# EAGLE design SIK-DIP-board (EAGLE 6.5.0)
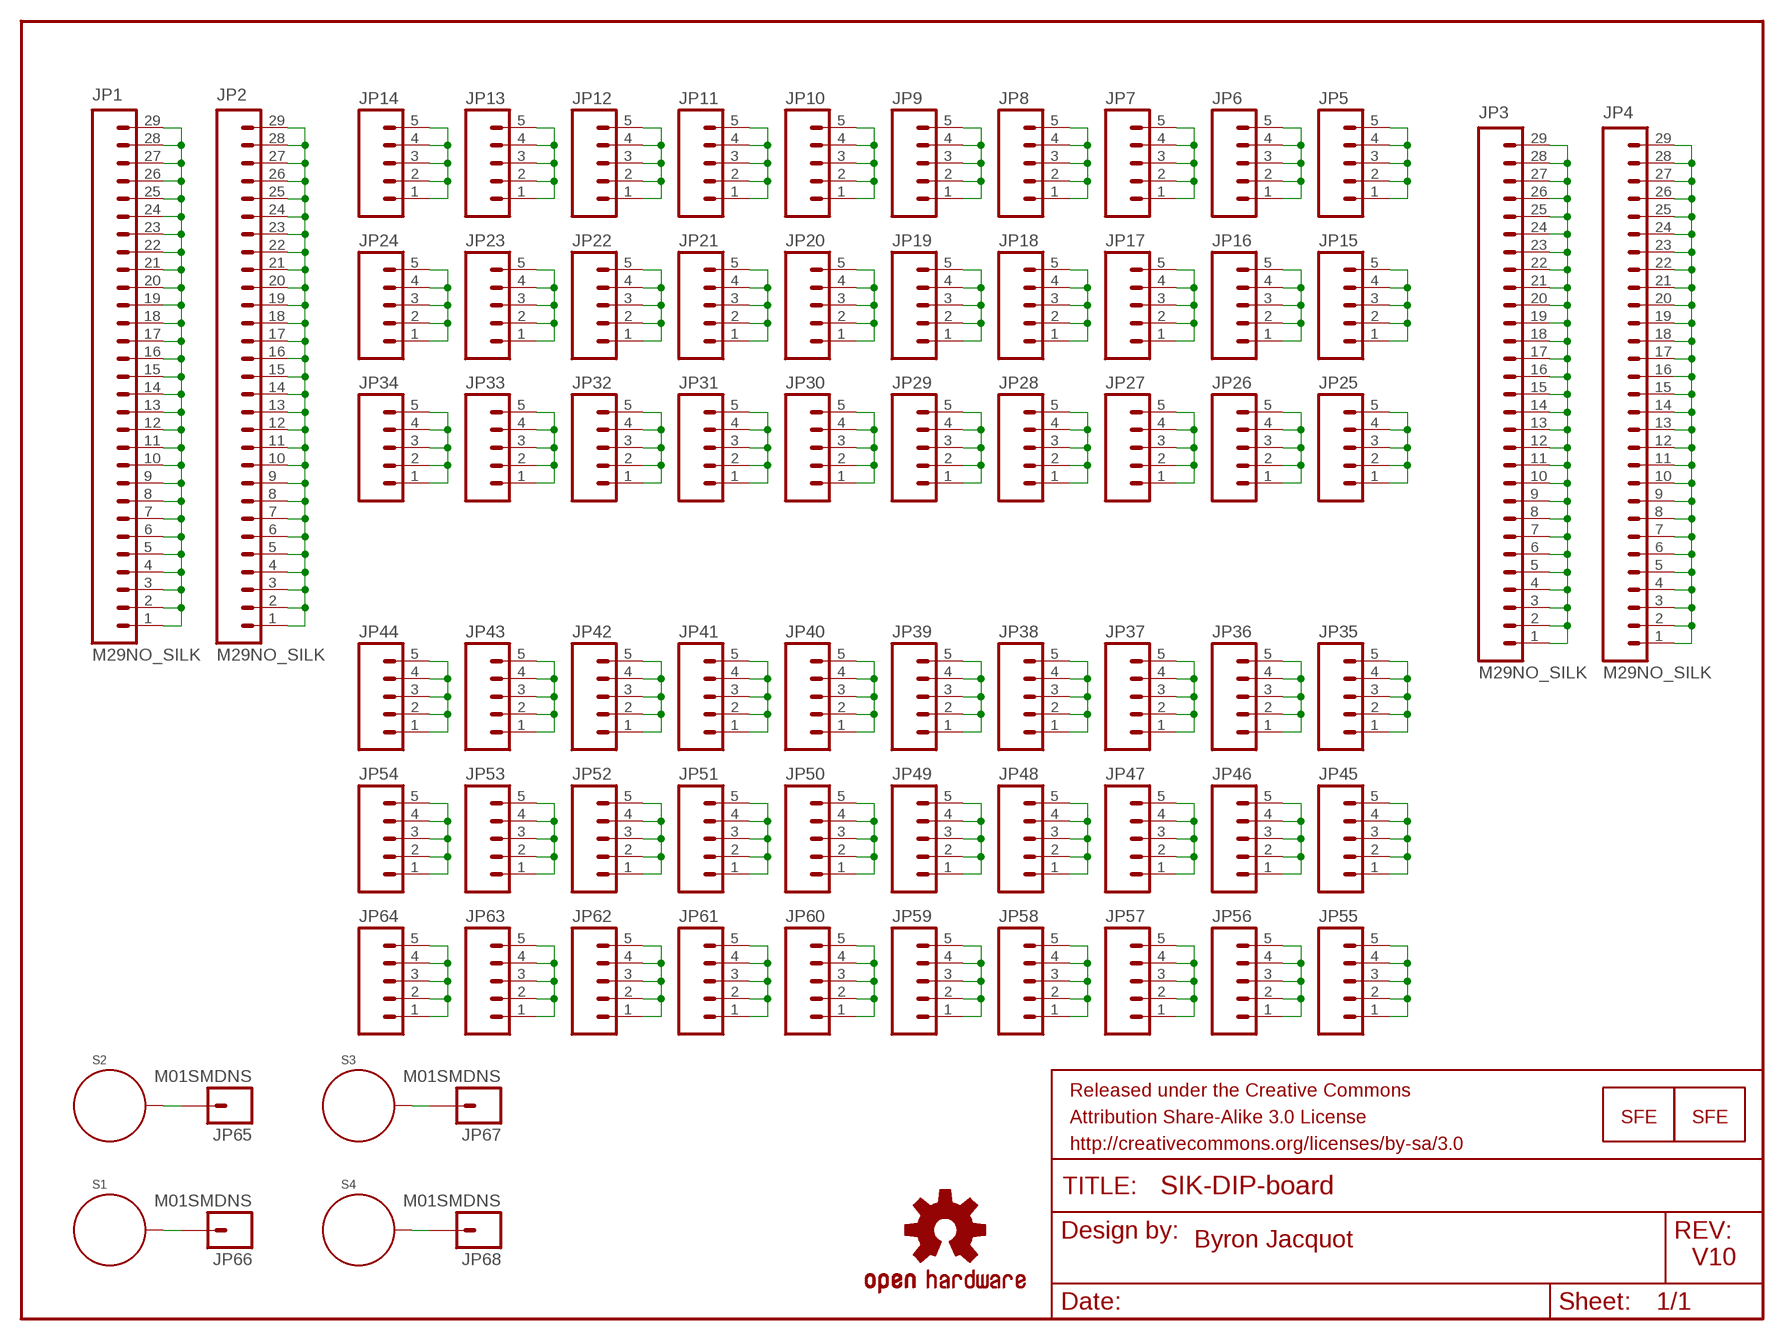
[diagram p0: schematic, sheet 1]

## Parts
FRAME1  FRAME-LETTER  [CREATIVE_COMMONS]
JP1  M29NO_SILK  [1X29_NO_SILK]
JP2  M29NO_SILK  [1X29_NO_SILK]
JP3  M29NO_SILK  [1X29_NO_SILK]
JP4  M29NO_SILK  [1X29_NO_SILK]
JP5  M05NO_SILK  [1X05_NO_SILK]
JP6  M05NO_SILK  [1X05_NO_SILK]
JP7  M05NO_SILK  [1X05_NO_SILK]
JP8  M05NO_SILK  [1X05_NO_SILK]
JP9  M05NO_SILK  [1X05_NO_SILK]
JP10  M05NO_SILK  [1X05_NO_SILK]
JP11  M05NO_SILK  [1X05_NO_SILK]
JP12  M05NO_SILK  [1X05_NO_SILK]
JP13  M05NO_SILK  [1X05_NO_SILK]
JP14  M05NO_SILK  [1X05_NO_SILK]
JP15  M05NO_SILK  [1X05_NO_SILK]
JP16  M05NO_SILK  [1X05_NO_SILK]
JP17  M05NO_SILK  [1X05_NO_SILK]
JP18  M05NO_SILK  [1X05_NO_SILK]
JP19  M05NO_SILK  [1X05_NO_SILK]
JP20  M05NO_SILK  [1X05_NO_SILK]
JP21  M05NO_SILK  [1X05_NO_SILK]
JP22  M05NO_SILK  [1X05_NO_SILK]
JP23  M05NO_SILK  [1X05_NO_SILK]
JP24  M05NO_SILK  [1X05_NO_SILK]
JP25  M05NO_SILK  [1X05_NO_SILK]
JP26  M05NO_SILK  [1X05_NO_SILK]
JP27  M05NO_SILK  [1X05_NO_SILK]
JP28  M05NO_SILK  [1X05_NO_SILK]
JP29  M05NO_SILK  [1X05_NO_SILK]
JP30  M05NO_SILK  [1X05_NO_SILK]
JP31  M05NO_SILK  [1X05_NO_SILK]
JP32  M05NO_SILK  [1X05_NO_SILK]
JP33  M05NO_SILK  [1X05_NO_SILK]
JP34  M05NO_SILK  [1X05_NO_SILK]
JP35  M05NO_SILK  [1X05_NO_SILK]
JP36  M05NO_SILK  [1X05_NO_SILK]
JP37  M05NO_SILK  [1X05_NO_SILK]
JP38  M05NO_SILK  [1X05_NO_SILK]
JP39  M05NO_SILK  [1X05_NO_SILK]
JP40  M05NO_SILK  [1X05_NO_SILK]
JP41  M05NO_SILK  [1X05_NO_SILK]
JP42  M05NO_SILK  [1X05_NO_SILK]
JP43  M05NO_SILK  [1X05_NO_SILK]
JP44  M05NO_SILK  [1X05_NO_SILK]
JP45  M05NO_SILK  [1X05_NO_SILK]
JP46  M05NO_SILK  [1X05_NO_SILK]
JP47  M05NO_SILK  [1X05_NO_SILK]
JP48  M05NO_SILK  [1X05_NO_SILK]
JP49  M05NO_SILK  [1X05_NO_SILK]
JP50  M05NO_SILK  [1X05_NO_SILK]
JP51  M05NO_SILK  [1X05_NO_SILK]
JP52  M05NO_SILK  [1X05_NO_SILK]
JP53  M05NO_SILK  [1X05_NO_SILK]
JP54  M05NO_SILK  [1X05_NO_SILK]
JP55  M05NO_SILK  [1X05_NO_SILK]
JP56  M05NO_SILK  [1X05_NO_SILK]
JP57  M05NO_SILK  [1X05_NO_SILK]
JP58  M05NO_SILK  [1X05_NO_SILK]
JP59  M05NO_SILK  [1X05_NO_SILK]
JP60  M05NO_SILK  [1X05_NO_SILK]
JP61  M05NO_SILK  [1X05_NO_SILK]
JP62  M05NO_SILK  [1X05_NO_SILK]
JP63  M05NO_SILK  [1X05_NO_SILK]
JP64  M05NO_SILK  [1X05_NO_SILK]
JP65  M01SMDNS  [1X01NS]
JP66  M01SMDNS  [1X01NS]
JP67  M01SMDNS  [1X01NS]
JP68  M01SMDNS  [1X01NS]
LOGO1  LOGO-SFECP  [SFE-LOGO-FLAME-COPPER]
LOGO2  LOGO-SFENEW  [SFE-NEW-WEBLOGO]
LOGO3  OSHW-LOGOS  [OSHW-LOGO-S]
S1  STANDOFF_ELECTRICAL  [STANDOFF-ELECTRICAL]
S2  STANDOFF_ELECTRICAL  [STANDOFF-ELECTRICAL]
S3  STANDOFF_ELECTRICAL  [STANDOFF-ELECTRICAL]
S4  STANDOFF_ELECTRICAL  [STANDOFF-ELECTRICAL]

## Nets
N$1: JP1.1 JP1.2 JP1.3 JP1.4 JP1.5 JP1.6 JP1.7 JP1.8 JP1.9 JP1.10 JP1.11 JP1.12 JP1.13 JP1.14 JP1.15 JP1.16 JP1.17 JP1.18 JP1.19 JP1.20 JP1.21 JP1.22 JP1.23 JP1.24 JP1.25 JP1.26 JP1.27 JP1.28 JP1.29
N$2: JP2.1 JP2.2 JP2.3 JP2.4 JP2.5 JP2.6 JP2.7 JP2.8 JP2.9 JP2.10 JP2.11 JP2.12 JP2.13 JP2.14 JP2.15 JP2.16 JP2.17 JP2.18 JP2.19 JP2.20 JP2.21 JP2.22 JP2.23 JP2.24 JP2.25 JP2.26 JP2.27 JP2.28 JP2.29
N$3: JP3.1 JP3.2 JP3.3 JP3.4 JP3.5 JP3.6 JP3.7 JP3.8 JP3.9 JP3.10 JP3.11 JP3.12 JP3.13 JP3.14 JP3.15 JP3.16 JP3.17 JP3.18 JP3.19 JP3.20 JP3.21 JP3.22 JP3.23 JP3.24 JP3.25 JP3.26 JP3.27 JP3.28 JP3.29
N$4: JP4.1 JP4.2 JP4.3 JP4.4 JP4.5 JP4.6 JP4.7 JP4.8 JP4.9 JP4.10 JP4.11 JP4.12 JP4.13 JP4.14 JP4.15 JP4.16 JP4.17 JP4.18 JP4.19 JP4.20 JP4.21 JP4.22 JP4.23 JP4.24 JP4.25 JP4.26 JP4.27 JP4.28 JP4.29
N$5: JP10.1 JP10.2 JP10.3 JP10.4 JP10.5
N$6: JP5.1 JP5.2 JP5.3 JP5.4 JP5.5
N$7: JP6.1 JP6.2 JP6.3 JP6.4 JP6.5
N$8: JP7.1 JP7.2 JP7.3 JP7.4 JP7.5
N$9: JP8.1 JP8.2 JP8.3 JP8.4 JP8.5
N$10: JP9.1 JP9.2 JP9.3 JP9.4 JP9.5
N$11: JP11.1 JP11.2 JP11.3 JP11.4 JP11.5
N$12: JP12.1 JP12.2 JP12.3 JP12.4 JP12.5
N$13: JP13.1 JP13.2 JP13.3 JP13.4 JP13.5
N$14: JP14.1 JP14.2 JP14.3 JP14.4 JP14.5
N$15: JP15.1 JP15.2 JP15.3 JP15.4 JP15.5
N$16: JP16.1 JP16.2 JP16.3 JP16.4 JP16.5
N$17: JP17.1 JP17.2 JP17.3 JP17.4 JP17.5
N$18: JP18.1 JP18.2 JP18.3 JP18.4 JP18.5
N$19: JP19.1 JP19.2 JP19.3 JP19.4 JP19.5
N$20: JP20.1 JP20.2 JP20.3 JP20.4 JP20.5
N$21: JP21.1 JP21.2 JP21.3 JP21.4 JP21.5
N$22: JP22.1 JP22.2 JP22.3 JP22.4 JP22.5
N$23: JP23.1 JP23.2 JP23.3 JP23.4 JP23.5
N$24: JP24.1 JP24.2 JP24.3 JP24.4 JP24.5
N$25: JP25.1 JP25.2 JP25.3 JP25.4 JP25.5
N$26: JP26.1 JP26.2 JP26.3 JP26.4 JP26.5
N$27: JP27.1 JP27.2 JP27.3 JP27.4 JP27.5
N$28: JP28.1 JP28.2 JP28.3 JP28.4 JP28.5
N$29: JP29.1 JP29.2 JP29.3 JP29.4 JP29.5
N$30: JP30.1 JP30.2 JP30.3 JP30.4 JP30.5
N$31: JP31.1 JP31.2 JP31.3 JP31.4 JP31.5
N$32: JP32.1 JP32.2 JP32.3 JP32.4 JP32.5
N$33: JP33.1 JP33.2 JP33.3 JP33.4 JP33.5
N$34: JP34.1 JP34.2 JP34.3 JP34.4 JP34.5
N$35: JP35.1 JP35.2 JP35.3 JP35.4 JP35.5
N$36: JP36.1 JP36.2 JP36.3 JP36.4 JP36.5
N$37: JP37.1 JP37.2 JP37.3 JP37.4 JP37.5
N$38: JP38.1 JP38.2 JP38.3 JP38.4 JP38.5
N$39: JP39.1 JP39.2 JP39.3 JP39.4 JP39.5
N$40: JP40.1 JP40.2 JP40.3 JP40.4 JP40.5
N$41: JP41.1 JP41.2 JP41.3 JP41.4 JP41.5
N$42: JP42.1 JP42.2 JP42.3 JP42.4 JP42.5
N$43: JP43.1 JP43.2 JP43.3 JP43.4 JP43.5
N$44: JP44.1 JP44.2 JP44.3 JP44.4 JP44.5
N$45: JP45.1 JP45.2 JP45.3 JP45.4 JP45.5
N$46: JP46.1 JP46.2 JP46.3 JP46.4 JP46.5
N$47: JP47.1 JP47.2 JP47.3 JP47.4 JP47.5
N$48: JP48.1 JP48.2 JP48.3 JP48.4 JP48.5
N$49: JP49.1 JP49.2 JP49.3 JP49.4 JP49.5
N$50: JP50.1 JP50.2 JP50.3 JP50.4 JP50.5
N$51: JP51.1 JP51.2 JP51.3 JP51.4 JP51.5
N$52: JP52.1 JP52.2 JP52.3 JP52.4 JP52.5
N$53: JP53.1 JP53.2 JP53.3 JP53.4 JP53.5
N$54: JP54.1 JP54.2 JP54.3 JP54.4 JP54.5
N$55: JP55.1 JP55.2 JP55.3 JP55.4 JP55.5
N$56: JP56.1 JP56.2 JP56.3 JP56.4 JP56.5
N$57: JP57.1 JP57.2 JP57.3 JP57.4 JP57.5
N$58: JP58.1 JP58.2 JP58.3 JP58.4 JP58.5
N$59: JP59.1 JP59.2 JP59.3 JP59.4 JP59.5
N$60: JP60.1 JP60.2 JP60.3 JP60.4 JP60.5
N$61: JP61.1 JP61.2 JP61.3 JP61.4 JP61.5
N$62: JP62.1 JP62.2 JP62.3 JP62.4 JP62.5
N$63: JP63.1 JP63.2 JP63.3 JP63.4 JP63.5
N$64: JP64.1 JP64.2 JP64.3 JP64.4 JP64.5
N$65: JP65.1 S2.P1
N$66: JP66.1 S1.P1
N$67: JP67.1 S3.P1
N$68: JP68.1 S4.P1

## Notes on the sheet
- Byron Jacquot
- V10

## Library data of the parts
FRAME1 = SparkFun-Aesthetics:FRAME-LETTER: Schematic Frame Standard 8.5x11 US Letter frame
JP1-JP4 = SparkFun-Connectors:M29: 1x29 .1" header
JP5-JP64 = SparkFun-Connectors:M05: Header 5 Standard 5-pin 0.1" header. Use with straight break away headers (SKU : PRT-00116), right angle break away headers (PRT-00553), swiss pins (PRT-00743), machine pins (PRT-00117), and female headers (PRT-00115). Molex polarized connector foot print use with SKU : PRT-08230 with associated crimp pins and housings.
JP65-JP68 = SparkFun-Connectors:M01: Header 1 Standard 1-pin 0.1" header. Use with straight break away headers (SKU : PRT-00116), right angle break away headers (PRT-00553), swiss pins (PRT-00743), machine pins (PRT-00117), and female headers (PRT-00115).
LOGO1 LOGO2 = SparkFun-Aesthetics:LOGO-SFE: Spark Fun Electronics PCB Logo This is the standard Spark Fun Electronics PCB logo.
LOGO3 = SparkFun-Aesthetics:OSHW-LOGO: Open Source Hardware Logo This logo indicates the piece of hardware it is found on incorporates a OSHW license and/or adheres to the definition of open source hardware found here: http://freedomdefined.org/OSHW
S1-S4 = SparkFun-Electromechanical:STANDOFF_ELECTRICAL: A standoff intended to be an electrically connected point. Pad size and stop size allow for a #4 Phillips pan screw head to make a solid connection to the board.

## Board
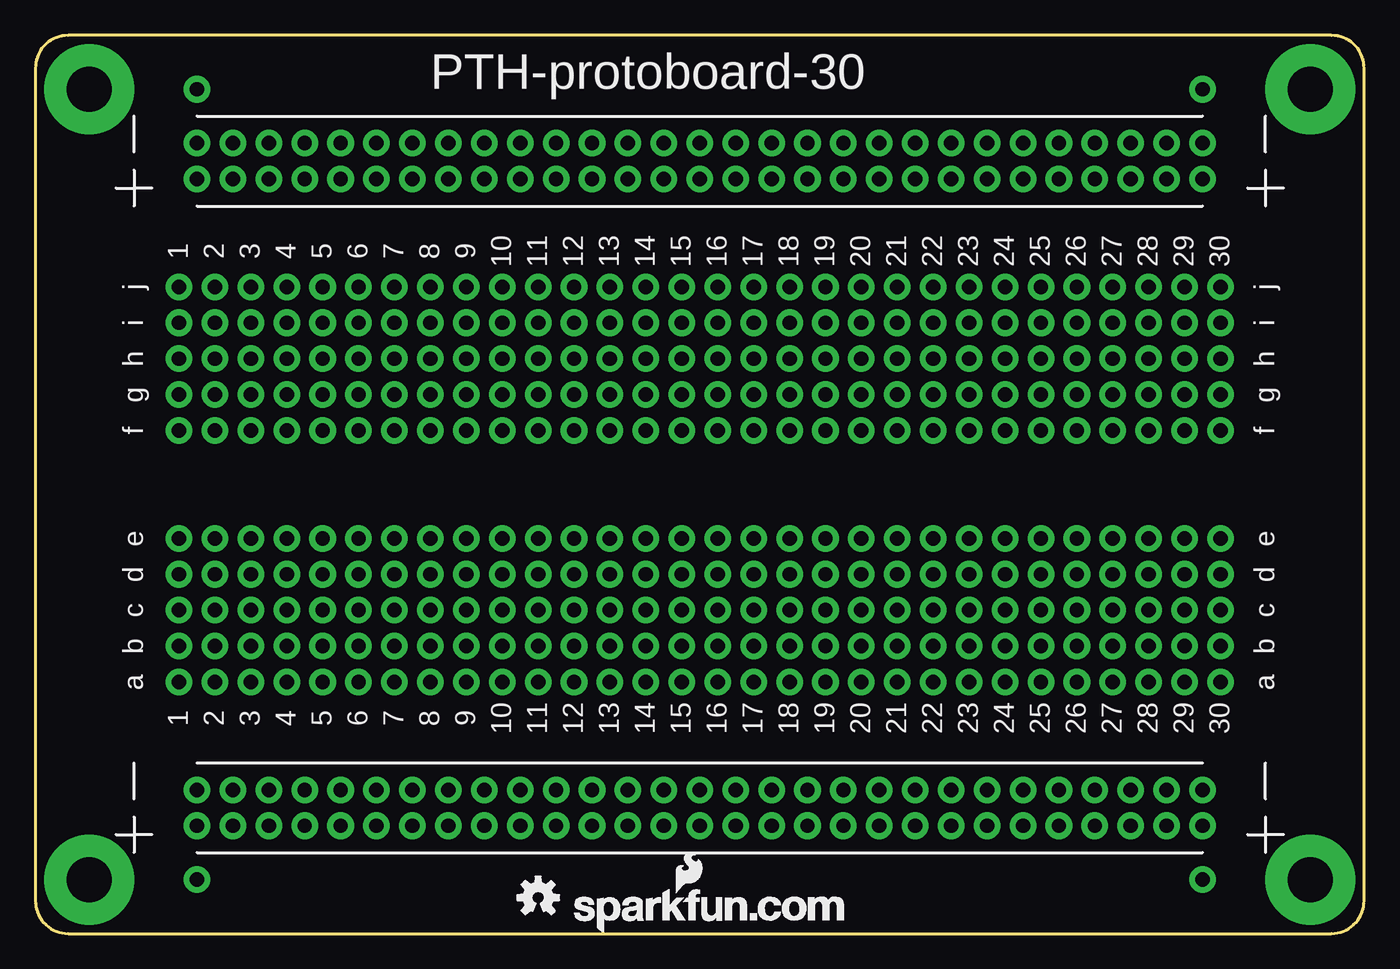
[diagram p1: board, top side]
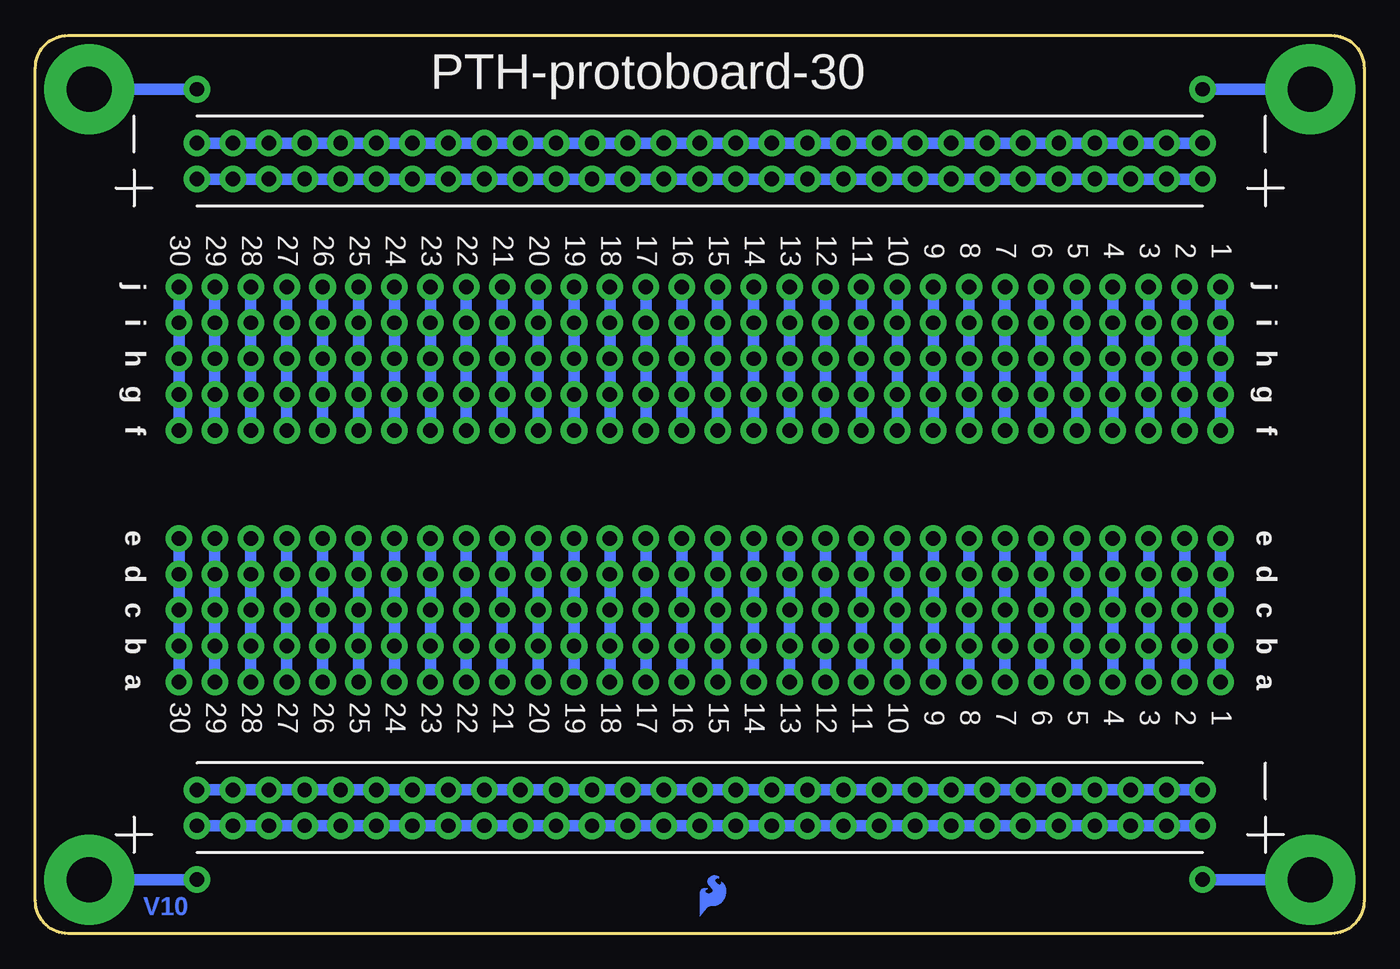
[diagram p2: board, bottom side, seen from below]

Size 93.98 x 63.5 mm. Coordinates in mm from the lower left corner, seen from the top.
Outline: 0,61.18 0,2.32 arc90 2.32,0 91.66,0 arc90 93.98,2.32 93.98,61.18 arc90 91.66,63.5 2.32,63.5 arc90 0,61.18
Copper layers (1*16): Top 0.035mm / dielectric 1.5mm / Bottom 0.035mm
Design rules "default": minimum track width 7mil, minimum drill 15mil, track to track 8mil, track to pad 8mil, pad to pad 8mil, via to via 8mil, smd to smd 8mil, copper to edge 8mil, drill to drill 8mil, minimum pad ring 12mil, minimum via ring 10mil, stop-mask expansion 4mil, vias tented up to drill 20mil, thermal gap 10mil

### Footprints (pad centres in the part's own frame; a part is rotated, then mirrored left to right if it is on the bottom)
1X29_NO_SILK = drill 1.016 pad 1.88: 1 0,0; 2 2.54,0; 3 5.08,0; 4 7.62,0; 5 10.16,0; 6 12.7,0; 7 15.24,0; 8 17.78,0; 9 20.32,0; 10 22.86,0; 11 25.4,0; 12 27.94,0; 13 30.48,0; 14 33.02,0; 15 35.56,0; 16 38.1,0; 17 40.64,0; 18 43.18,0; 19 45.72,0; 20 48.26,0; 21 50.8,0; 22 53.34,0; 23 55.88,0; 24 58.42,0; 25 60.96,0; 26 63.5,0; 27 66.04,0; 28 68.58,0; 29 71.12,0
1X05_NO_SILK = drill 1.016 pad 1.88: 1 0,0; 2 2.54,0; 3 5.08,0; 4 7.62,0; 5 10.16,0
1X01NS = drill 1.016 pad 1.88: 1 0,0
STANDOFF-ELECTRICAL = drill 3.2 pad 6.35: P1 0,0

### Placement (x,y rotation side)
FRAME1  26.67,-10.16 0 top  (outside the outline)
JP1  11.43,55.88 0 top
JP2  11.43,53.34 0 top
JP3  11.43,10.16 0 top
JP4  11.43,7.62 0 top
JP5  10.16,17.78 90 top
JP6  12.7,17.78 90 top
JP7  15.24,17.78 90 top
JP8  17.78,17.78 90 top
JP9  20.32,17.78 90 top
JP10  22.86,17.78 90 top
JP11  25.4,17.78 90 top
JP12  27.94,17.78 90 top
JP13  30.48,17.78 90 top
JP14  33.02,17.78 90 top
JP15  35.56,17.78 90 top
JP16  38.1,17.78 90 top
JP17  40.64,17.78 90 top
JP18  43.18,17.78 90 top
JP19  45.72,17.78 90 top
JP20  48.26,17.78 90 top
JP21  50.8,17.78 90 top
JP22  53.34,17.78 90 top
JP23  55.88,17.78 90 top
JP24  58.42,17.78 90 top
JP25  60.96,17.78 90 top
JP26  63.5,17.78 90 top
JP27  66.04,17.78 90 top
JP28  68.58,17.78 90 top
JP29  71.12,17.78 90 top
JP30  73.66,17.78 90 top
JP31  76.2,17.78 90 top
JP32  78.74,17.78 90 top
JP33  81.28,17.78 90 top
JP34  83.82,17.78 90 top
JP35  10.16,35.56 90 top
JP36  12.7,35.56 90 top
JP37  15.24,35.56 90 top
JP38  17.78,35.56 90 top
JP39  20.32,35.56 90 top
JP40  22.86,35.56 90 top
JP41  25.4,35.56 90 top
JP42  27.94,35.56 90 top
JP43  30.48,35.56 90 top
JP44  33.02,35.56 90 top
JP45  35.56,35.56 90 top
JP46  40.64,35.56 90 top
JP47  38.1,35.56 90 top
JP48  43.18,35.56 90 top
JP49  45.72,35.56 90 top
JP50  48.26,35.56 90 top
JP51  50.8,35.56 90 top
JP52  53.34,35.56 90 top
JP53  55.88,35.56 90 top
JP54  58.42,35.56 90 top
JP55  60.96,35.56 90 top
JP56  63.5,35.56 90 top
JP57  66.04,35.56 90 top
JP58  68.58,35.56 90 top
JP59  71.12,35.56 90 top
JP60  73.66,35.56 90 top
JP61  76.2,35.56 90 top
JP62  78.74,35.56 90 top
JP63  81.28,35.56 90 top
JP64  83.82,35.56 90 top
JP65  82.55,59.69 0 top
JP66  11.43,59.69 0 top
JP67  11.43,3.81 0 top
JP68  82.55,3.81 0 top
LOGO1  46.99,1.27 0 bottom
LOGO2  38.1,0 0 top
LOGO3  35.56,2.54 0 top
S1  3.81,59.69 0 top
S2  90.17,59.69 0 top
S3  3.81,3.81 0 top
S4  90.17,3.81 0 top

### Tracks (layer width: path | path; a pad name or v marks a point on that pad's centre or on a via)
N$1
  Bottom 0.813: JP1.1 JP1.2 JP1.3 JP1.4 JP1.5 JP1.6 JP1.7 JP1.8 JP1.9 JP1.10 JP1.11 JP1.12 JP1.13 JP1.14 JP1.15 JP1.16 JP1.17 JP1.18 JP1.19 JP1.20 JP1.21 JP1.22 JP1.23 JP1.24 JP1.25 JP1.26 JP1.27 JP1.28 JP1.29
N$2
  Bottom 0.813: JP2.29 JP2.28 JP2.27 JP2.26 JP2.25 JP2.24 JP2.23 JP2.22 JP2.21 JP2.20 JP2.19 JP2.18 JP2.17 JP2.16 JP2.15 JP2.14 JP2.13 JP2.12 JP2.11 JP2.10 JP2.9 JP2.8 JP2.7 JP2.6 JP2.5 JP2.4 JP2.3 JP2.2 JP2.1
N$3
  Bottom 0.813: JP3.1 JP3.2 JP3.3 JP3.4 JP3.5 JP3.6 JP3.7 JP3.8 JP3.9 JP3.10 JP3.11 JP3.12 JP3.13 JP3.14 JP3.15 JP3.16 JP3.17 JP3.18 JP3.19 JP3.20 JP3.21 JP3.22 JP3.23 JP3.24 JP3.25 JP3.26 JP3.27 JP3.28 JP3.29
N$4
  Bottom 0.813: JP4.1 JP4.2 JP4.3 JP4.4 JP4.5 JP4.6 JP4.7 JP4.8 JP4.9 JP4.10 JP4.11 JP4.12 JP4.13 JP4.14 JP4.15 JP4.16 JP4.17 JP4.18 JP4.19 JP4.20 JP4.21 JP4.22 JP4.23 JP4.24 JP4.25 JP4.26 JP4.27 JP4.28 JP4.29
N$5
  Bottom 0.813: JP10.1 JP10.2 JP10.3 JP10.4 JP10.5
N$6
  Bottom 0.813: JP5.5 JP5.4 JP5.3 JP5.2 JP5.1
N$7
  Bottom 0.813: JP6.1 JP6.2 JP6.3 JP6.4 JP6.5
N$8
  Bottom 0.813: JP7.5 JP7.4 JP7.3 JP7.2 JP7.1
N$9
  Bottom 0.813: JP8.1 JP8.2 JP8.3 JP8.4 JP8.5
N$10
  Bottom 0.813: JP9.5 JP9.4 JP9.3 JP9.2 JP9.1
N$11
  Bottom 0.813: JP11.5 JP11.4 JP11.3 JP11.2 JP11.1
N$12
  Bottom 0.813: JP12.1 JP12.2 JP12.3 JP12.4 JP12.5
N$13
  Bottom 0.813: JP13.5 JP13.4 JP13.3 JP13.2 JP13.1
N$14
  Bottom 0.813: JP14.1 JP14.2 JP14.3 JP14.4 JP14.5
N$15
  Bottom 0.813: JP15.5 JP15.4 JP15.3 JP15.2 JP15.1
N$16
  Bottom 0.813: JP16.1 JP16.2 JP16.3 JP16.4 JP16.5
N$17
  Bottom 0.813: JP17.1 JP17.2 JP17.3 JP17.4 JP17.5
N$18
  Bottom 0.813: JP18.5 JP18.4 JP18.3 JP18.2 JP18.1
N$19
  Bottom 0.813: JP19.1 JP19.2 JP19.3 JP19.4 JP19.5
N$20
  Bottom 0.813: JP20.5 JP20.4 JP20.3 JP20.2 JP20.1
N$21
  Bottom 0.813: JP21.1 JP21.2 JP21.3 JP21.4 JP21.5
N$22
  Bottom 0.813: JP22.5 JP22.4 JP22.3 JP22.2 JP22.1
N$23
  Bottom 0.813: JP23.1 JP23.2 JP23.3 JP23.4 JP23.5
N$24
  Bottom 0.813: JP24.5 JP24.4 JP24.3 JP24.2 JP24.1
N$25
  Bottom 0.813: JP25.1 JP25.2 JP25.3 JP25.4 JP25.5
N$26
  Bottom 0.813: JP26.5 JP26.4 JP26.3 JP26.2 JP26.1
N$27
  Bottom 0.813: JP27.1 JP27.2 JP27.3 JP27.4 JP27.5
N$28
  Bottom 0.813: JP28.5 JP28.4 JP28.3 JP28.2 JP28.1
N$29
  Bottom 0.813: JP29.1 JP29.2 JP29.3 JP29.4 JP29.5
N$30
  Bottom 0.813: JP30.5 JP30.4 JP30.3 JP30.2 JP30.1
N$31
  Bottom 0.813: JP31.1 JP31.2 JP31.3 JP31.4 JP31.5
N$32
  Bottom 0.813: JP32.5 JP32.4 JP32.3 JP32.2 JP32.1
N$33
  Bottom 0.813: JP33.1 JP33.2 JP33.3 JP33.4 JP33.5
N$34
  Bottom 0.813: JP34.5 JP34.4 JP34.3 JP34.2 JP34.1
N$35
  Bottom 0.813: JP35.5 JP35.4 JP35.3 JP35.2 JP35.1
N$36
  Bottom 0.813: JP36.1 JP36.2 JP36.3 JP36.4 JP36.5
N$37
  Bottom 0.813: JP37.5 JP37.4 JP37.3 JP37.2 JP37.1
N$38
  Bottom 0.813: JP38.1 JP38.2 JP38.3 JP38.4 JP38.5
N$39
  Bottom 0.813: JP39.5 JP39.4 JP39.3 JP39.2 JP39.1
N$40
  Bottom 0.813: JP40.1 JP40.2 JP40.3 JP40.4 JP40.5
N$41
  Bottom 0.813: JP41.5 JP41.4 JP41.3 JP41.2 JP41.1
N$42
  Bottom 0.813: JP42.1 JP42.2 JP42.3 JP42.4 JP42.5
N$43
  Bottom 0.813: JP43.5 JP43.4 JP43.3 JP43.2 JP43.1
N$44
  Bottom 0.813: JP44.1 JP44.2 JP44.3 JP44.4 JP44.5
N$45
  Bottom 0.813: JP45.5 JP45.4 JP45.3 JP45.2 JP45.1
N$46
  Bottom 0.813: JP46.5 JP46.4 JP46.3 JP46.2 JP46.1
N$47
  Bottom 0.813: JP47.1 JP47.2 JP47.3 JP47.4 JP47.5
N$48
  Bottom 0.813: JP48.1 JP48.2 JP48.3 JP48.4 JP48.5
N$49
  Bottom 0.813: JP49.5 JP49.4 JP49.3 JP49.2 JP49.1
N$50
  Bottom 0.813: JP50.1 JP50.2 JP50.3 JP50.4 JP50.5
N$51
  Bottom 0.813: JP51.5 JP51.4 JP51.3 JP51.2 JP51.1
N$52
  Bottom 0.813: JP52.1 JP52.2 JP52.3 JP52.4 JP52.5
N$53
  Bottom 0.813: JP53.5 JP53.4 JP53.3 JP53.2 JP53.1
N$54
  Bottom 0.813: JP54.5 JP54.4 JP54.3 JP54.2 JP54.1
N$55
  Bottom 0.813: JP55.1 JP55.2 JP55.3 JP55.4 JP55.5
N$56
  Bottom 0.813: JP56.5 JP56.4 JP56.3 JP56.2 JP56.1
N$57
  Bottom 0.813: JP57.1 JP57.2 JP57.3 JP57.4 JP57.5
N$58
  Bottom 0.813: JP58.5 JP58.4 JP58.3 JP58.2 JP58.1
N$59
  Bottom 0.813: JP59.1 JP59.2 JP59.3 JP59.4 JP59.5
N$60
  Bottom 0.813: JP60.5 JP60.4 JP60.3 JP60.2 JP60.1
N$61
  Bottom 0.813: JP61.1 JP61.2 JP61.3 JP61.4 JP61.5
N$62
  Bottom 0.813: JP62.5 JP62.4 JP62.3 JP62.2 JP62.1
N$63
  Bottom 0.813: JP63.1 JP63.2 JP63.3 JP63.4 JP63.5
N$64
  Bottom 0.813: JP64.5 JP64.4 JP64.3 JP64.2 JP64.1
N$65
  Bottom 0.813: JP65.1 S2.P1
N$66
  Bottom 0.813: JP66.1 S1.P1
N$67
  Bottom 0.813: JP67.1 S3.P1
N$68
  Bottom 0.813: JP68.1 S4.P1

### Text on the board
Bottom: V10
tPlace: PTH-protoboard-30 | 1 | 2 | 3 | 4 | 5 | 6 | 7 | 8 | 9 | 10 | 11 | 12 | 13 | 14 | 15 | 16 | 17 | 18 | 19 | 20 | 21 | 22 | 23 | 24 | 25 | 26 | 27 | 28 | 29 | 30 | j | j | i | i | h | h | g | g | f | f | e | e | d | d | c | c | b | b | a | a | 1 | 2 | 3 | 4 | 5 | 6 | 7 | 8 | 9 | 10 | 11 | 12 | 13 | 14 | 15 | 16 | 17 | 18 | 19 | 20 | 21 | 22 | 23 | 24 | 25 | 26 | 27 | 28 | 29 | 30
bPlace: PTH-protoboard-30 | 1 | 2 | 3 | 4 | 5 | 6 | 7 | 8 | 9 | 10 | 11 | 12 | 13 | 14 | 15 | 16 | 17 | 18 | 19 | 20 | 21 | 22 | 23 | 24 | 25 | 26 | 27 | 28 | 29 | 30 | j | j | i | i | h | h | g | g | f | f | e | e | d | d | c | c | b | b | a | a | 1 | 2 | 3 | 4 | 5 | 6 | 7 | 8 | 9 | 10 | 11 | 12 | 13 | 14 | 15 | 16 | 17 | 18 | 19 | 20 | 21 | 22 | 23 | 24 | 25 | 26 | 27 | 28 | 29 | 30
tValues: Byron Jacquot